# EAGLE design pmi_encoder_rs422_decoder (EAGLE 6.5.0)
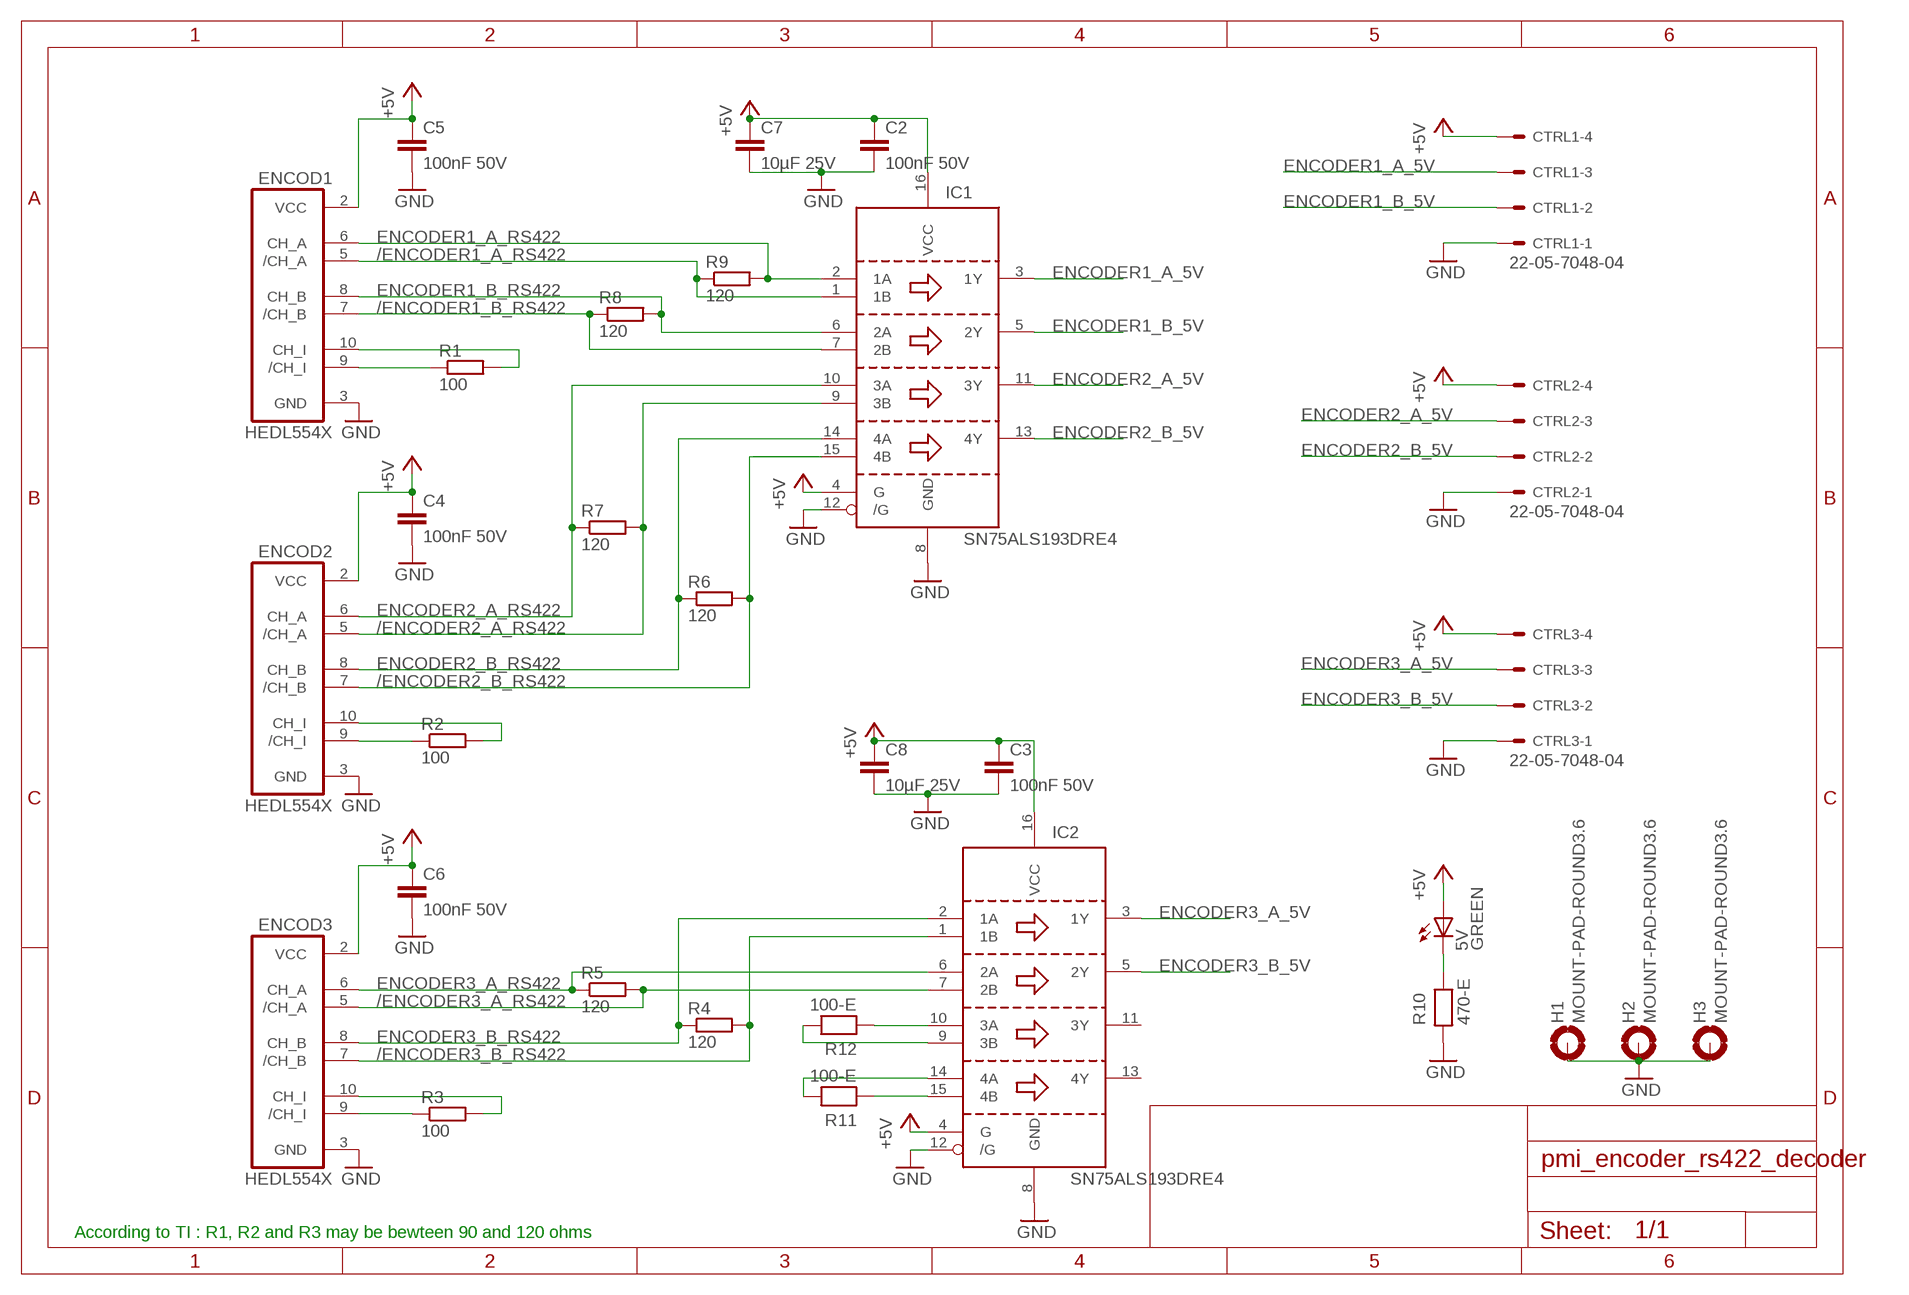
[diagram p0: schematic, sheet 1]

## Parts
5V  GREEN  LED_G  [CHIP-LED0805]
C2  100nF 50V  100NF-E  [C0805]
C3  100nF 50V  100NF-E  [C0805]
C4  100nF 50V  100NF-E  [C0805]
C5  100nF 50V  100NF-E  [C0805]
C6  100nF 50V  100NF-E  [C0805]
C7  10µF 25V  10UF-C_25V  [C1210]
C8  10µF 25V  10UF-C_25V  [C1210]
CTRL1  22-05-7048-04  [7395-04]
CTRL2  22-05-7048-04  [7395-04]
CTRL3  22-05-7048-04  [7395-04]
ENCOD1  HEDL554X  [ML10]
ENCOD2  HEDL554X  [ML10]
ENCOD3  HEDL554X  [ML10]
H1  MOUNT-PAD-ROUND3.6  [3,6-PAD]
H2  MOUNT-PAD-ROUND3.6  [3,6-PAD]
H3  MOUNT-PAD-ROUND3.6  [3,6-PAD]
IC1  SN75ALS193DRE4  [SO16]
IC2  SN75ALS193DRE4  [SO16]
R1  100  R-EU_0207/7  [0207/7]
R2  100  R-EU_0207/7  [0207/7]
R3  100  R-EU_0207/7  [0207/7]
R4  120  R-EU_0207/7  [0207/7]
R5  120  R-EU_0207/7  [0207/7]
R6  120  R-EU_0207/7  [0207/7]
R7  120  R-EU_0207/7  [0207/7]
R8  120  R-EU_0207/7  [0207/7]
R9  120  R-EU_0207/7  [0207/7]
R10  470-E  [R0805]
R11  100-E  [R0805]
R12  100-E  [R0805]

## Nets
+5V: 5V.A C2.1 C3.1 C4.1 C5.1 C6.1 C7.1 C8.1 CTRL1.4 CTRL2.4 CTRL3.4 ENCOD1.2(VCC) ENCOD2.2(VCC) ENCOD3.2(VCC) IC1.4(G) IC1.16(VCC) IC2.4(G) IC2.16(VCC)
/ENCODER1_A_RS422: ENCOD1.5(/CH_A) IC1.1(1B) R9.1
/ENCODER1_B_RS422: ENCOD1.7(/CH_B) IC1.7(2B) R8.1
/ENCODER2_A_RS422: ENCOD2.5(/CH_A) IC1.9(3B) R7.2
/ENCODER2_B_RS422: ENCOD2.7(/CH_B) IC1.15(4B) R6.2
/ENCODER3_A_RS422: ENCOD3.5(/CH_A) IC2.7(2B) R5.2
/ENCODER3_B_RS422: ENCOD3.7(/CH_B) IC2.1(1B) R4.2
ENCODER1_A_5V: CTRL1.3 IC1.3(1Y)
ENCODER1_A_RS422: ENCOD1.6(CH_A) IC1.2(1A) R9.2
ENCODER1_B_5V: CTRL1.2 IC1.5(2Y)
ENCODER1_B_RS422: ENCOD1.8(CH_B) IC1.6(2A) R8.2
ENCODER2_A_5V: CTRL2.3 IC1.11(3Y)
ENCODER2_A_RS422: ENCOD2.6(CH_A) IC1.10(3A) R7.1
ENCODER2_B_5V: CTRL2.2 IC1.13(4Y)
ENCODER2_B_RS422: ENCOD2.8(CH_B) IC1.14(4A) R6.1
ENCODER3_A_5V: CTRL3.3 IC2.3(1Y)
ENCODER3_A_RS422: ENCOD3.6(CH_A) IC2.6(2A) R5.1
ENCODER3_B_5V: CTRL3.2 IC2.5(2Y)
ENCODER3_B_RS422: ENCOD3.8(CH_B) IC2.2(1A) R4.1
GND: C2.2 C3.2 C4.2 C5.2 C6.2 C7.2 C8.2 CTRL1.1 CTRL2.1 CTRL3.1 ENCOD1.3(GND) ENCOD2.3(GND) ENCOD3.3(GND) H1.B3,6(MOUNT) H2.B3,6(MOUNT) H3.B3,6(MOUNT) IC1.8(GND) IC1.12(/G) IC2.8(GND) IC2.12(/G) R10.1
N$1: ENCOD3.10(CH_I) R3.2
N$2: ENCOD3.9(/CH_I) R3.1
N$3: ENCOD2.9(/CH_I) R2.1
N$4: ENCOD2.10(CH_I) R2.2
N$5: ENCOD1.10(CH_I) R1.2
N$6: 5V.C R10.2
N$7: IC2.14(4A) R11.2
N$8: IC2.9(3B) R12.2
N$9: IC2.10(3A) R12.1
N$10: ENCOD1.9(/CH_I) R1.1
N$11: IC2.15(4B) R11.1
Unconnected: IC2.11(3Y) IC2.13(4Y)

## Notes on the sheet
- According to TI : R1, R2 and R3 may be bewteen 90 and 120 ohms

## Library data of the parts
5V = robotter_diode:LED_; MOUSER: 859-LTST-C171GKT; RS: 692-0935
C2-C6 = robotter_capacitor:100NF; MOUSER: 81-GRM40Y104Z50D; RS: 220-7966
C7 C8 = robotter_capacitor:10UF; MOUSER: 963-TMK316BJ106KL-T; RS: 766-1185
CTRL1-CTRL3 = robotter_connector:22-?-04: CONNECTOR wire to board 2.54 mm (.1 inch) pitch header; OC_FARNELL: unknown; OC_NEWARK: unknown
ENCOD1-ENCOD3 = robotter_connector:HEDL554X
H1-H3 = holes:MOUNT-PAD-ROUND: MOUNTING PAD, round
IC1 IC2 = robotter_ic:SN75ALS193; MOUSER: 595-SN75ALS193D; RS: 660-9256
R1-R9 = resistor:R-EU_: RESISTOR, European symbol
R10 = robotter_resistor:470; MOUSER: 652-CR0805-FX4700GLF; RS: 740-9038
R11 R12 = robotter_resistor:100; MOUSER: 603-AF0805FR-07100RL; RS: 223-0297

## Board
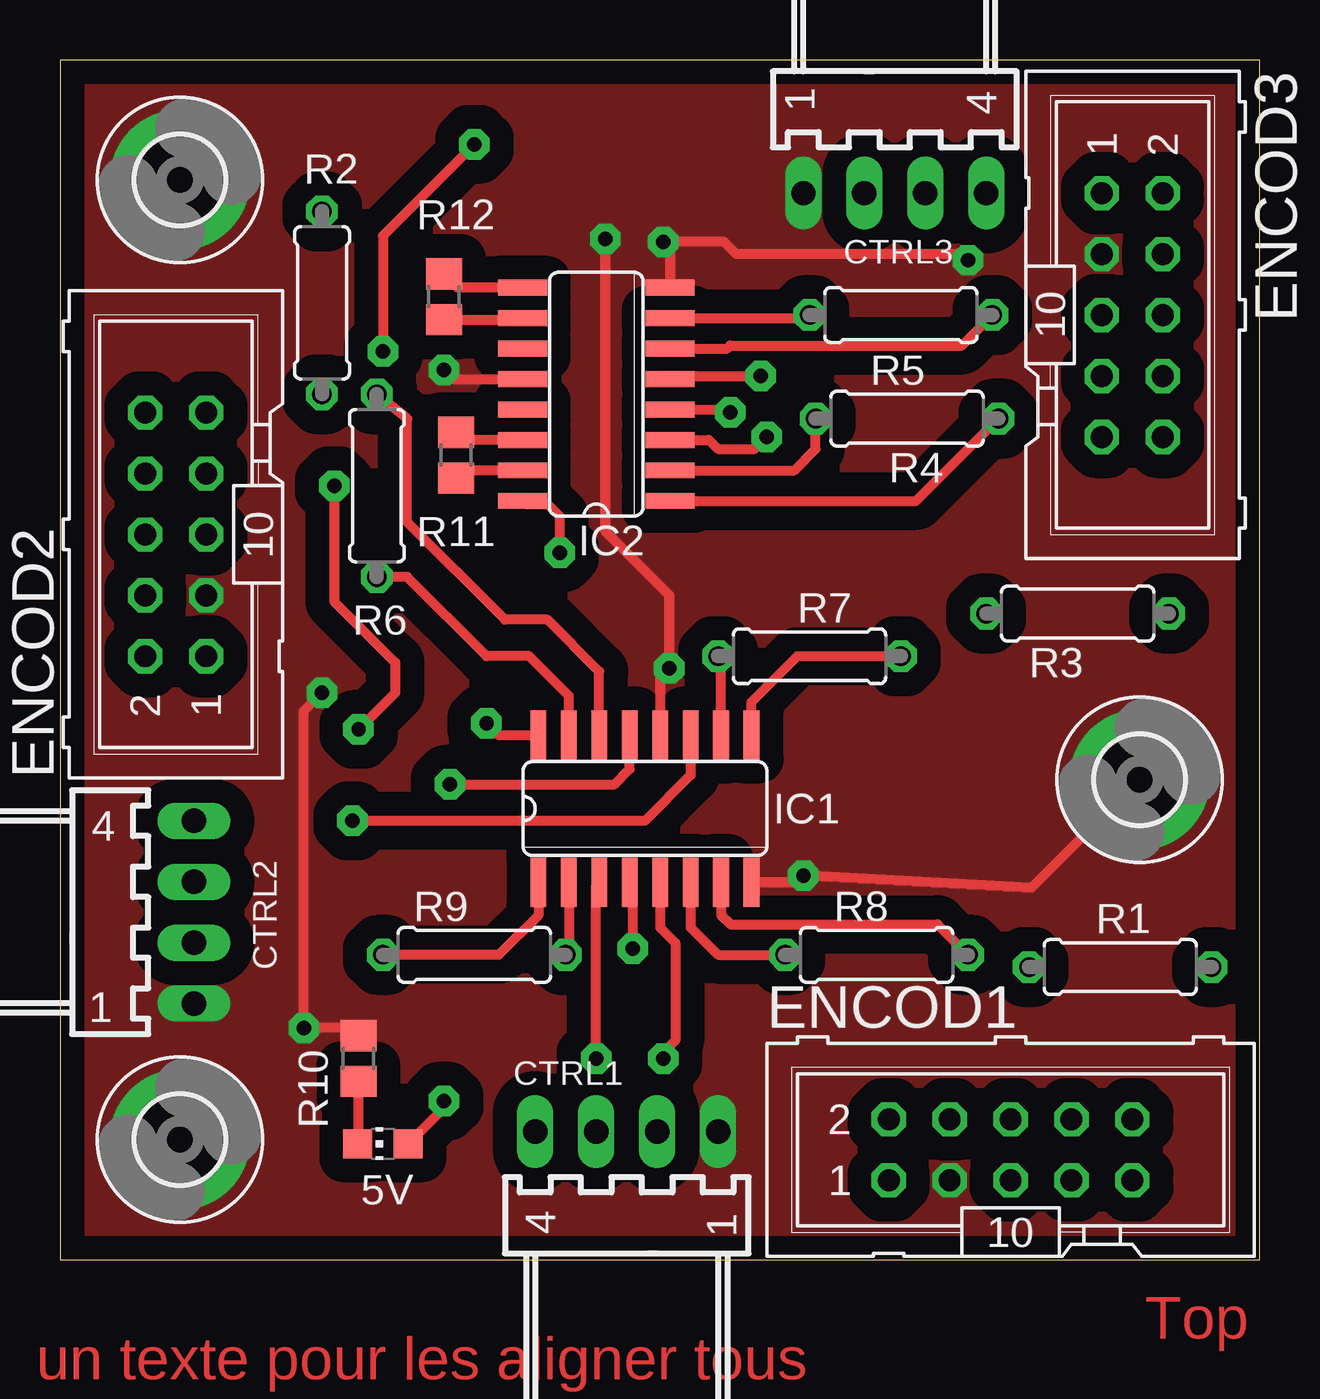
[diagram p1: board, top side]
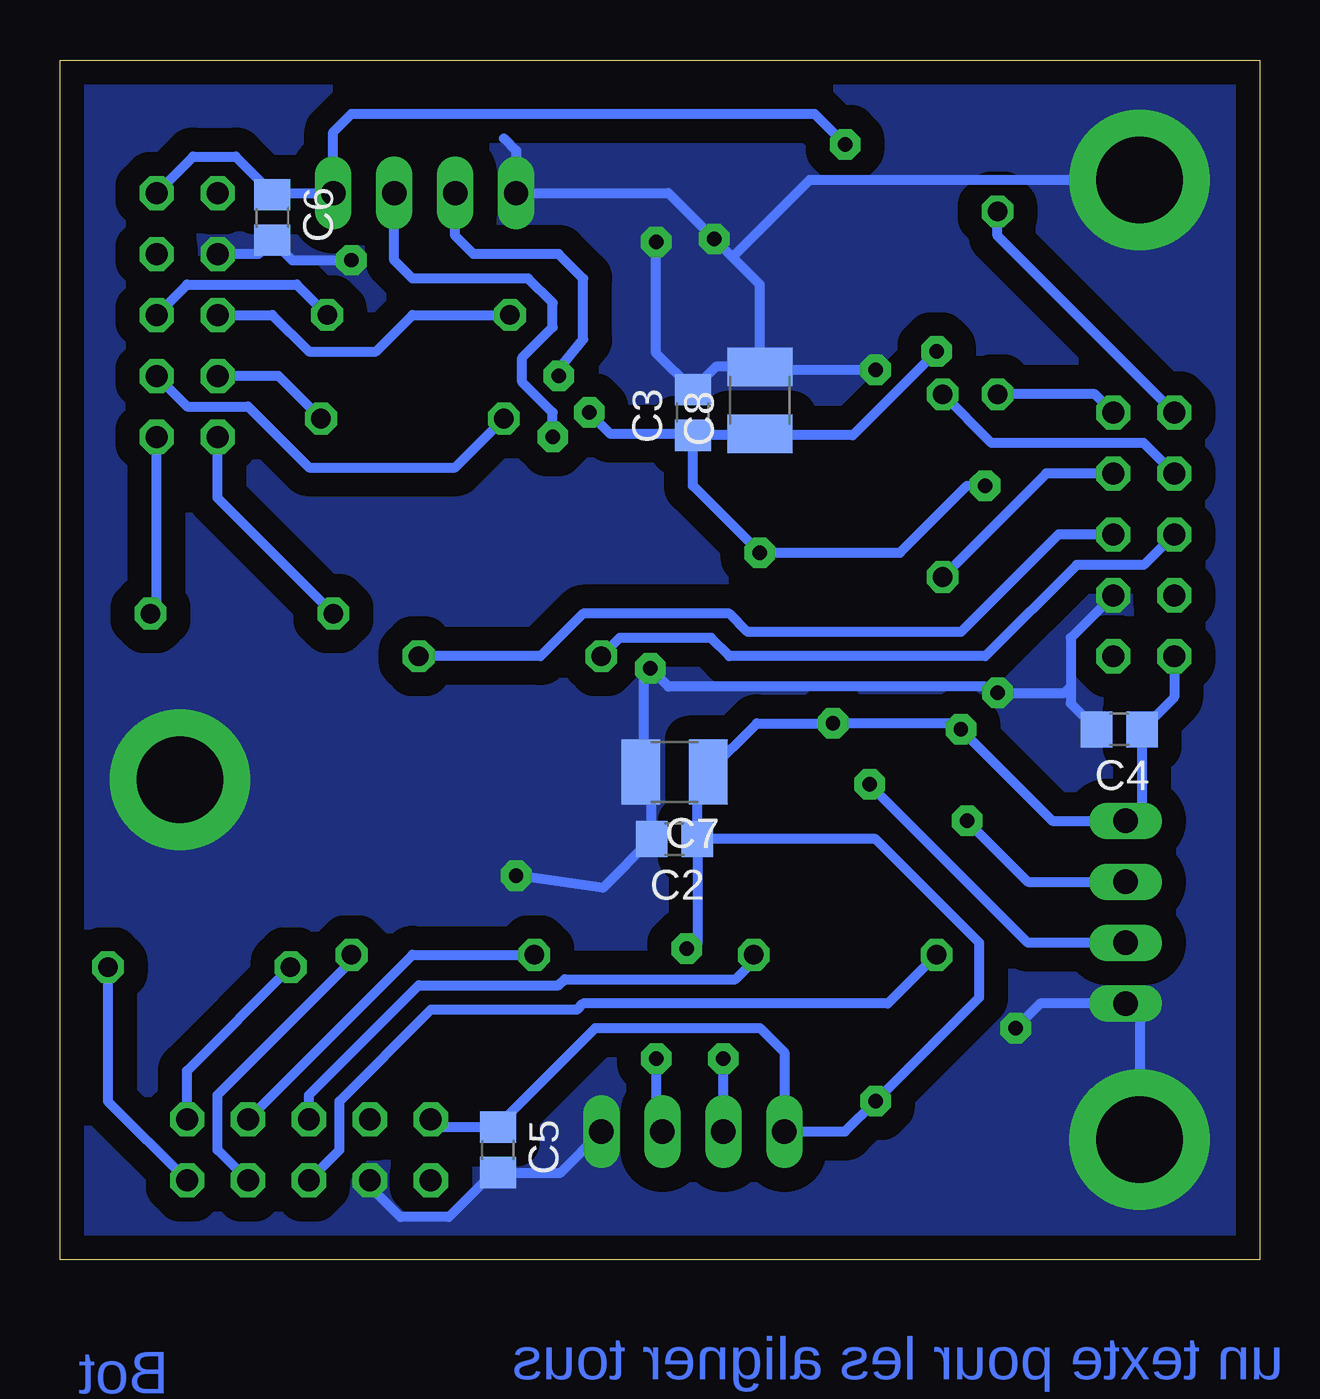
[diagram p2: board, bottom side, seen from below]

Size 50 x 50 mm. Coordinates in mm from the lower left corner, seen from the top.
Outline: 0,0 50,0 50,50 0,50 0,0
Copper layers (1*16): Top 0.035mm / dielectric 1.5mm / Bottom 0.035mm
Design rules "default *": minimum track width 10mil, minimum drill 0.6mm, track to track 1mm, track to pad 1mm, pad to pad 1mm, via to via 1mm, smd to smd 1mm, copper to edge 1mm, drill to drill 8mil, minimum pad ring 10mil, minimum via ring 8mil, stop-mask expansion 4mil, vias tented up to drill 0mil, thermal gap 10mil

### Footprints (pad centres in the part's own frame; a part is rotated, then mirrored left to right if it is on the bottom)
CHIP-LED0805 = smd 1.2 x 1.2: A 0,-1.05; C 0,1.05
C0805 = smd 1.3 x 1.5: 1 -0.95,0; 2 0.95,0
C1210 = smd 1.6 x 2.7: 1 -1.4,0; 2 1.4,0
7395-04 = drill 1.016 long: 1 3.81,0; 2 1.27,0; 3 -1.27,0; 4 -3.81,0
ML10 = drill 0.914 octagon: 1 -5.08,-1.27; 2 -5.08,1.27; 3 -2.54,-1.27; 4 -2.54,1.27; 5 0,-1.27; 6 0,1.27; 7 2.54,-1.27; 8 2.54,1.27; 9 5.08,-1.27; 10 5.08,1.27
3,6-PAD = drill 3.6 pad 5.842: B3,6 0,0
SO16 = smd 0.66 x 2.032: 1 -4.445,-3.073; 2 -3.175,-3.073; 3 -1.905,-3.073; 4 -0.635,-3.073; 5 0.635,-3.073; 6 1.905,-3.073; 7 3.175,-3.073; 8 4.445,-3.073; 9 4.445,3.073; 10 3.175,3.073; 11 1.905,3.073; 12 0.635,3.073; 13 -0.635,3.073; 14 -1.905,3.073; 15 -3.175,3.073; 16 -4.445,3.073
0207/7 = drill 0.813 octagon: 1 -3.81,0; 2 3.81,0
R0805 = smd 1.3 x 1.5: 1 -0.95,0; 2 0.95,0

### Placement (x,y rotation side)
5V  13.46,4.83 90 top
C2  24.38,17.53 180 bottom
C3  23.62,35.31 90 bottom
C4  5.84,22.1 180 bottom
C5  31.75,4.57 270 bottom
C6  41.15,43.43 270 bottom
C7  24.38,20.32 180 bottom
C8  20.83,35.81 90 bottom
CTRL1  23.62,5.33 0 top
CTRL2  5.59,14.48 270 top
CTRL3  34.8,44.45 180 top
ENCOD1  39.62,4.57 0 top
ENCOD2  4.83,30.23 90 top
ENCOD3  44.7,39.37 270 top
H1  5,45 0 top
H2  45,20 0 top
H3  5,5 0 top
IC1  24.38,18.8 0 top
IC2  22.35,36.07 90 top
R1  44.2,12.19 180 top
R2  10.92,39.88 90 top
R3  42.42,26.92 0 top
R4  35.31,35.05 0 top
R5  35.05,39.37 180 top
R6  13.21,32.26 270 top
R7  31.24,25.15 0 top
R8  34.04,12.7 180 top
R9  17.27,12.7 0 top
R10  12.45,8.38 270 top
R11  16.51,33.53 90 top
R12  16,40.13 90 top

### Tracks (layer width: path | path; a pad name or v marks a point on that pad's centre or on a via)
+5V  (via drill 0.6 pad 1.27)
  Top 0.406: v23.88,12.95 23.88,15.6 IC1.4 | IC2.4 27.81,35.43 v27.94,35.31 | IC1.16 18.26,21.87 v17.78,22.35 | v17.27,46.48 13.46,42.67 v13.46,37.85 | IC2.16 19.41,31.5 20.32,31.5 20.83,30.99 v20.83,29.46 | v11.43,32.26 11.43,27.43 13.97,24.89 13.97,23.62 v12.45,22.1 | 5V.A 16,6.32 v16,6.6
  Bottom 0.406: ENCOD2.2 3.56,23.43 C4.1 4.89,18.98 CTRL2.4 8.64,18.29 v12.45,22.1 12.7,22.35 v17.78,22.35 20.95,22.35 C7.1 23.43,19.87 C2.1 | ENCOD1.2 34.22,5.52 C5.1 31.75,5.59 27.69,9.65 20.83,9.65 19.81,8.64 CTRL1.4 17.27,5.33 v16,6.6 11.68,10.92 11.68,13.21 16,17.53 C2.1 | C2.1 23.43,13.14 v23.88,12.95 | C3.1 23.68,34.61 23.88,34.41 27.05,34.41 v27.94,35.31 | C8.1 20.89,34.36 | 20.89,34.36 C3.1 | ENCOD3.2 44.45,45.97 42.67,45.97 41.15,44.45 C6.1 41.08,44.45 CTRL3.4 38.61,46.99 37.85,47.75 18.54,47.75 v17.27,46.48 | C3.1 23.62,32.26 v20.83,29.46 14.99,29.46 12.19,32.26 v11.43,32.26 | v13.46,37.85 16.95,34.36 20.89,34.36
/ENCODER1_A_RS422
  Top 0.406: IC1.1 19.94,14.35 18.29,12.7 R9.1
  Bottom 0.406: ENCOD1.5 38.35,4.57 38.35,6.6 34.54,10.41 28.45,10.41 28.19,10.67 15.49,10.67 R9.1
/ENCODER1_B_RS422
  Top 0.406: IC1.7 27.56,14.35 27.94,13.97 36.58,13.97 R8.1
  Bottom 0.406: ENCOD1.7 43.43,4.57 43.43,6.86 37.85,12.45 R8.1
/ENCODER2_A_RS422
  Top 0.406: IC1.9 28.83,23.24 30.73,25.15 R7.2
  Bottom 0.406: ENCOD2.5 8.38,30.23 11.68,26.92 12.45,26.16 21.34,26.16 22.1,26.92 28.19,26.92 29.97,25.15 R7.2
/ENCODER2_B_RS422
  Top 0.406: IC1.15 21.21,23.5 19.56,25.15 17.78,25.15 14.48,28.45 R6.2
  Bottom 0.406: ENCOD2.7 8.89,32.77 R6.2
/ENCODER3_A_RS422
  Top 0.406: IC2.7 31.11,39.24 R5.2
  Bottom 0.406: R5.2 35.31,39.37 36.83,37.85 39.62,37.85 41.15,39.37 ENCOD3.5
/ENCODER3_B_RS422
  Top 0.406: IC2.1 35.69,31.62 R4.2
  Bottom 0.406: R4.2 40.89,36.83 ENCOD3.7
ENCODER1_A_5V  (via drill 0.6 pad 1.27)
  Top 0.406: v22.35,8.38 22.35,15.6 IC1.3
  Bottom 0.406: CTRL1.3 v22.35,8.38
ENCODER1_A_RS422
  Top 0.406: IC1.2 21.21,12.32 R9.2
  Bottom 0.406: ENCOD1.6 39.62,6.86 35.05,11.43 29.21,11.43 28.96,11.68 21.84,11.68 21.08,12.45 R9.2
ENCODER1_B_5V  (via drill 0.6 pad 1.27)
  Top 0.406: 25.02,5.46 CTRL1.2 | IC1.5 25.02,13.84 25.65,13.21 25.65,9.14 25.15,8.64 25.02,8.51 v25.15,8.38
  Bottom 0.406: v25.15,8.38 25.15,5.59 CTRL1.2
ENCODER1_B_RS422
  Top 0.406: IC1.6 26.29,13.84 27.43,12.7 R8.2
  Bottom 0.406: ENCOD1.8 35.31,12.7 R8.2
ENCODER2_A_5V  (via drill 0.6 pad 1.27)
  Top 0.406: IC1.11 26.29,20.19 24.38,18.29 v12.19,18.29
  Bottom 0.406: v12.19,18.29 9.65,15.75 CTRL2.3
ENCODER2_A_RS422
  Top 0.406: IC1.10 27.56,25.02 R7.1
  Bottom 0.406: ENCOD2.6 4.83,28.96 7.62,28.96 11.43,25.15 22.1,25.15 22.86,25.91 26.67,25.91 R7.1
ENCODER2_B_5V  (via drill 0.6 pad 1.27)
  Top 0.406: v16.26,19.81 23.11,19.81 23.75,20.45 IC1.13
  Bottom 0.406: CTRL2.2 9.65,13.21 v16.26,19.81
ENCODER2_B_RS422
  Top 0.406: IC1.14 22.48,24.51 20.32,26.67 18.54,26.67 14.48,30.73 14.48,35.05 R6.1
  Bottom 0.406: ENCOD2.8 4.83,34.04 11.18,34.04 R6.1
ENCODER3_A_5V  (via drill 0.6 pad 1.27)
  Top 0.406: IC2.3 27.05,34.16 27.43,33.78 28.96,33.78 v29.46,34.29
  Bottom 0.406: v29.46,34.29 29.46,35.31 30.73,36.58 30.73,37.59 29.46,38.86 29.46,39.88 30.48,40.89 35.31,40.89 36.07,41.66 CTRL3.3
ENCODER3_A_RS422
  Top 0.406: IC2.6 27.81,37.97 27.94,38.1 37.59,38.1 R5.1
  Bottom 0.406: ENCOD3.6 44.7,40.64 40.13,40.64 R5.1
ENCODER3_B_5V  (via drill 0.6 pad 1.27)
  Top 0.406: IC2.5 25.55,36.83 v29.21,36.83
  Bottom 0.406: v29.21,36.83 29.21,37.08 28.19,38.35 28.19,40.89 29.21,41.91 32.77,41.91 33.53,42.67 CTRL3.2
ENCODER3_B_RS422
  Top 0.406: IC2.2 30.61,32.89 31.5,33.78 R4.1
  Bottom 0.406: ENCOD3.8 44.7,35.56 42.16,35.56 39.62,33.02 33.53,33.02 R4.1
GND  (via drill 0.6 pad 1.27)
  Top 0.406: IC1.12 25.02,24.26 v25.4,24.64 25.4,27.69 22.73,30.35 v22.73,42.55 | IC2.8 25.43,42.14 v25.15,42.42 27.69,42.42 28.19,41.91 37.59,41.91 v37.85,41.66 | IC1.8 30.76,15.72 v30.99,16 40.49,15.49 H2.B3,6 | v10.92,23.62 10.16,22.86 v10.16,9.65 12.13,9.65 R10.1 | v16,37.08 16.38,36.7 IC2.12
  Bottom 0.406: ENCOD2.3 7.87,25.91 7.87,23.88 | 7.87,23.88 7.87,23.18 C4.2 6.86,22.03 | 31.5,46.74 30.99,46.23 CTRL3.1 24.64,44.45 v22.73,42.55 21.97,41.78 | ENCOD1.3 37.08,3.05 35.81,1.78 33.78,1.78 31.94,3.62 C5.2 29.14,3.62 CTRL1.1 | C3.2 23.17,36.51 | v25.15,42.42 25.15,37.78 C3.2 | C8.2 20.83,40.64 21.97,41.78 | C8.2 22.66,37.21 C3.2 | H3.B3,6 5,10.08 CTRL2.1 9.14,10.67 v10.16,9.65 | v30.99,16 27.37,15.49 C2.2 25.33,19.87 C7.2 25.65,20.45 25.65,24.38 v25.4,24.64 24.64,23.88 11.43,23.88 11.18,23.62 v10.92,23.62 8.13,23.62 7.87,23.88 | H1.B3,6 18.75,45 21.97,41.78 | C8.2 20.7,37.08 v16,37.08 | ENCOD3.3 41.72,41.91 C6.2 40.32,41.66 v37.85,41.66
  pour Bottom (no thermals): 0,-0.51 50.04,-0.51 50.04,49.78 0,49.78
  pour Top (no thermals): 0,-0.51 50.04,-0.51 50.04,50.04 0,50.04
N$1
  Bottom 0.406: R3.2 45.97,27.18 ENCOD3.10
N$2
  Bottom 0.406: R3.1 43.43,31.75 ENCOD3.9
N$3
  Bottom 0.406: ENCOD2.9 6.86,36.07 R2.1
N$4
  Bottom 0.406: ENCOD2.10 10.92,42.67 R2.2
N$5
  Bottom 0.406: ENCOD1.10 44.7,7.87 R1.2
N$6
  Top 0.406: 5V.C 12.45,4.86 R10.2
N$7
  Top 0.406: IC2.14 16.82,34.16 R11.2
N$8
  Top 0.406: IC2.9 16.57,40.51 R12.2
N$9
  Top 0.406: R12.1 19.22,39.18 IC2.10
N$10
  Bottom 0.406: R1.1 48.01,6.6 ENCOD1.9
N$11
  Top 0.406: IC2.15 16.82,32.89 R11.1

### Text on the board
Top: Top | un texte pour les aligner tous
Bottom: un texte pour les aligner tous | Bot